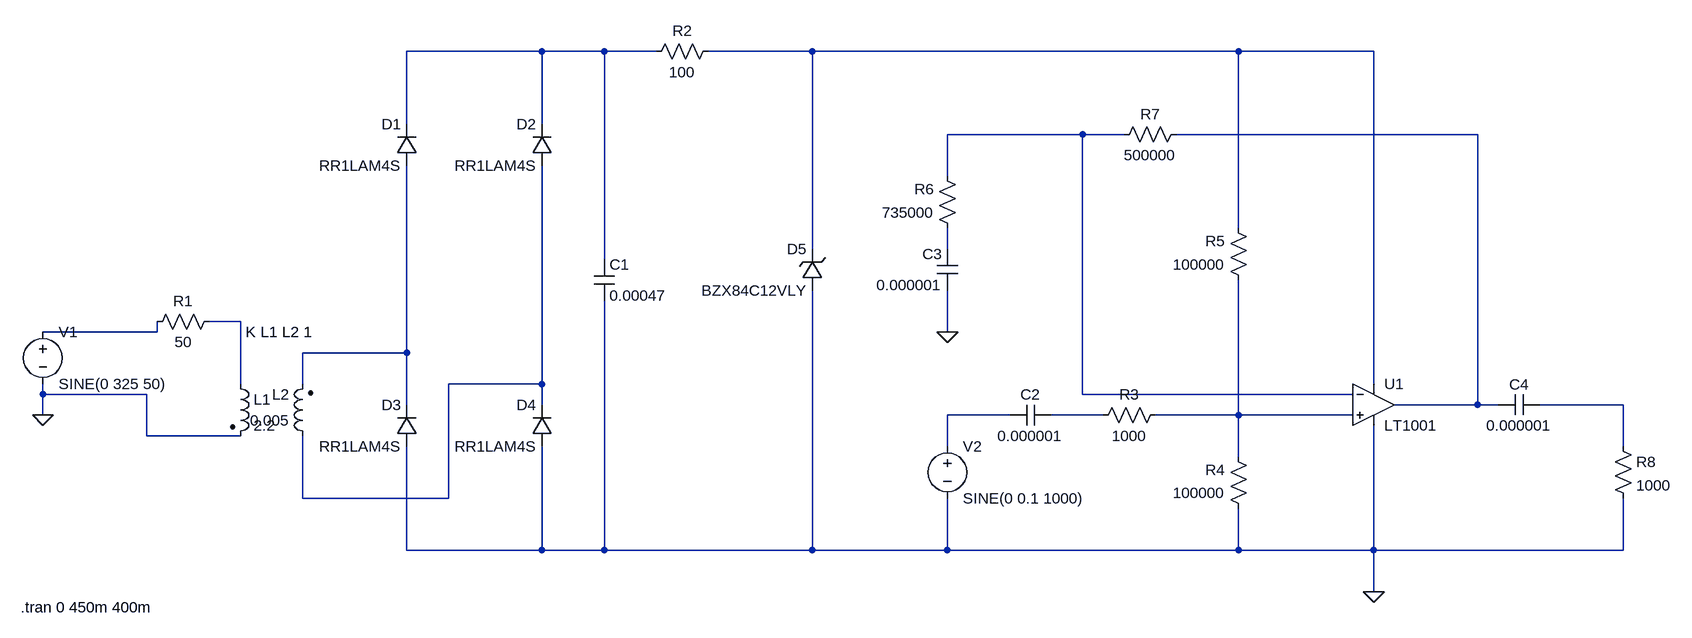
[diagram p0: schematic schematic design.asc]
schematic design.asc, the LTspice schematic file:
Version 4
SHEET 1 2596 680
WIRE 848 -528 640 -528
WIRE 944 -528 848 -528
WIRE 1024 -528 944 -528
WIRE 1264 -528 1104 -528
WIRE 1920 -528 1264 -528
WIRE 2128 -528 1920 -528
WIRE 640 -416 640 -528
WIRE 848 -416 848 -528
WIRE 1680 -400 1472 -400
WIRE 1744 -400 1680 -400
WIRE 2288 -400 1824 -400
WIRE 1472 -336 1472 -400
WIRE 1920 -256 1920 -528
WIRE 1264 -224 1264 -528
WIRE 1472 -224 1472 -256
WIRE 944 -208 944 -528
WIRE 384 -112 336 -112
WIRE 256 -96 256 -112
WIRE 256 -96 80 -96
WIRE 1472 -96 1472 -160
WIRE 640 -64 640 -352
WIRE 640 -64 480 -64
WIRE 384 -16 384 -112
WIRE 480 -16 480 -64
WIRE 848 -16 848 -352
WIRE 848 -16 704 -16
WIRE 2128 -16 2128 -528
WIRE 80 0 80 -16
WIRE 240 0 80 0
WIRE 1680 0 1680 -400
WIRE 2096 0 1680 0
WIRE 640 16 640 -64
WIRE 848 16 848 -16
WIRE 2288 16 2288 -400
WIRE 2288 16 2160 16
WIRE 2320 16 2288 16
WIRE 2512 16 2384 16
WIRE 80 32 80 0
WIRE 1568 32 1472 32
WIRE 1712 32 1632 32
WIRE 1920 32 1920 -176
WIRE 1920 32 1792 32
WIRE 2096 32 1920 32
WIRE 240 64 240 0
WIRE 384 64 240 64
WIRE 1472 80 1472 32
WIRE 2512 80 2512 16
WIRE 1920 96 1920 32
WIRE 480 160 480 64
WIRE 704 160 704 -16
WIRE 704 160 480 160
WIRE 640 240 640 80
WIRE 848 240 848 80
WIRE 848 240 640 240
WIRE 944 240 944 -144
WIRE 944 240 848 240
WIRE 1264 240 1264 -160
WIRE 1264 240 944 240
WIRE 1472 240 1472 160
WIRE 1472 240 1264 240
WIRE 1920 240 1920 176
WIRE 1920 240 1472 240
WIRE 2128 240 2128 48
WIRE 2128 240 1920 240
WIRE 2512 240 2512 160
WIRE 2512 240 2128 240
WIRE 2128 304 2128 240
FLAG 80 32 0
FLAG 1472 -96 0
FLAG 2128 304 0
DATAFLAG 640 240 ""
SYMBOL res 352 -128 R90
WINDOW 0 0 56 VBottom 2
WINDOW 3 32 56 VTop 2
SYMATTR InstName R1
SYMATTR Value 50
SYMBOL diode 656 -352 R180
WINDOW 0 24 64 Left 2
WINDOW 3 24 0 Left 2
SYMATTR InstName D1
SYMATTR Value RR1LAM4S
SYMBOL diode 864 -352 R180
WINDOW 0 24 64 Left 2
WINDOW 3 24 0 Left 2
SYMATTR InstName D2
SYMATTR Value RR1LAM4S
SYMBOL diode 656 80 R180
WINDOW 0 24 64 Left 2
WINDOW 3 24 0 Left 2
SYMATTR InstName D3
SYMATTR Value RR1LAM4S
SYMBOL diode 864 80 R180
WINDOW 0 24 64 Left 2
WINDOW 3 24 0 Left 2
SYMATTR InstName D4
SYMATTR Value RR1LAM4S
SYMBOL cap 928 -208 R0
SYMATTR InstName C1
SYMATTR Value 0.00047
SYMBOL res 1120 -544 R90
WINDOW 0 0 56 VBottom 2
WINDOW 3 32 56 VTop 2
SYMATTR InstName R2
SYMATTR Value 100
SYMBOL zener 1280 -160 R180
WINDOW 0 24 64 Left 2
WINDOW 3 24 0 Left 2
SYMATTR InstName D5
SYMATTR Value BZX84C12VLY
SYMATTR Description Diode
SYMATTR Type diode
SYMBOL voltage 80 -112 R0
WINDOW 123 0 0 Left 0
WINDOW 39 24 44 Left 2
SYMATTR InstName V1
SYMATTR Value SINE(0 325 50)
SYMBOL voltage 1472 64 R0
WINDOW 123 0 0 Left 0
WINDOW 39 0 0 Left 0
SYMATTR InstName V2
SYMATTR Value SINE(0 0.1 1000)
SYMBOL cap 1632 16 R90
WINDOW 0 0 32 VBottom 2
WINDOW 3 32 32 VTop 2
SYMATTR InstName C2
SYMATTR Value 0.000001
SYMBOL res 1808 16 R90
WINDOW 0 0 56 VBottom 2
WINDOW 3 32 56 VTop 2
SYMATTR InstName R3
SYMATTR Value 1000
SYMBOL res 1936 192 R180
WINDOW 0 36 76 Left 2
WINDOW 3 36 40 Left 2
SYMATTR InstName R4
SYMATTR Value 100000
SYMBOL res 1936 -160 R180
WINDOW 0 36 76 Left 2
WINDOW 3 36 40 Left 2
SYMATTR InstName R5
SYMATTR Value 100000
SYMBOL res 1488 -240 R180
WINDOW 0 36 76 Left 2
WINDOW 3 36 40 Left 2
SYMATTR InstName R6
SYMATTR Value 735000
SYMBOL res 1728 -384 R270
WINDOW 0 32 56 VTop 2
WINDOW 3 0 56 VBottom 2
SYMATTR InstName R7
SYMATTR Value 500000
SYMBOL cap 1488 -160 R180
WINDOW 0 24 56 Left 2
WINDOW 3 24 8 Left 2
SYMATTR InstName C3
SYMATTR Value 0.000001
SYMBOL cap 2384 0 R90
WINDOW 0 0 32 VBottom 2
WINDOW 3 32 32 VTop 2
SYMATTR InstName C4
SYMATTR Value 0.000001
SYMBOL OpAmps\\LT1001 2128 -48 R0
SYMATTR InstName U1
SYMBOL res 2496 64 R0
SYMATTR InstName R8
SYMATTR Value 1000
SYMBOL ind2 368 -32 R0
SYMATTR InstName L1
SYMATTR Value 2.2
SYMBOL ind2 496 80 R180
WINDOW 0 36 80 Left 2
WINDOW 3 36 40 Left 2
SYMATTR InstName L2
SYMATTR Value 0.005
TEXT 392 -96 Left 2 !K L1 L2 1
TEXT 46 328 Left 2 !.tran 0 450m 400m

The netlist it stands for:
* schematic design.asc
R1 N006 N007 50
D1 N008 N001 RR1LAM4S
D2 N009 N001 RR1LAM4S
D3 0 N008 RR1LAM4S
D4 0 N009 RR1LAM4S
C1 N001 0 0.00047
R2 N002 N001 100
D5 0 N002 BZX84C12VLY
V1 N007 0 SINE(0 325 50)
V2 N011 0 SINE(0 0.1 1000)
C2 N012 N011 0.000001
R3 N013 N012 1000
R4 0 N013 100000
R5 N013 N002 100000
R6 N005 N003 735000
R7 N003 N004 500000
C3 0 N005 0.000001
C4 N010 N004 0.000001
XU1 N013 N003 N002 0 N004 LT1001  ; pins In+ In- V+ V- OUT
R8 N010 0 1000
L1 N006 0 2.2
L2 N009 N008 0.005
.model D D
.lib standard.dio
K L1 L2 1
.tran 0 450m 400m
.lib LTC.lib
.backanno
.end